# EAGLE schematic IMD_AMS_Latch (EAGLE 9.2.2)
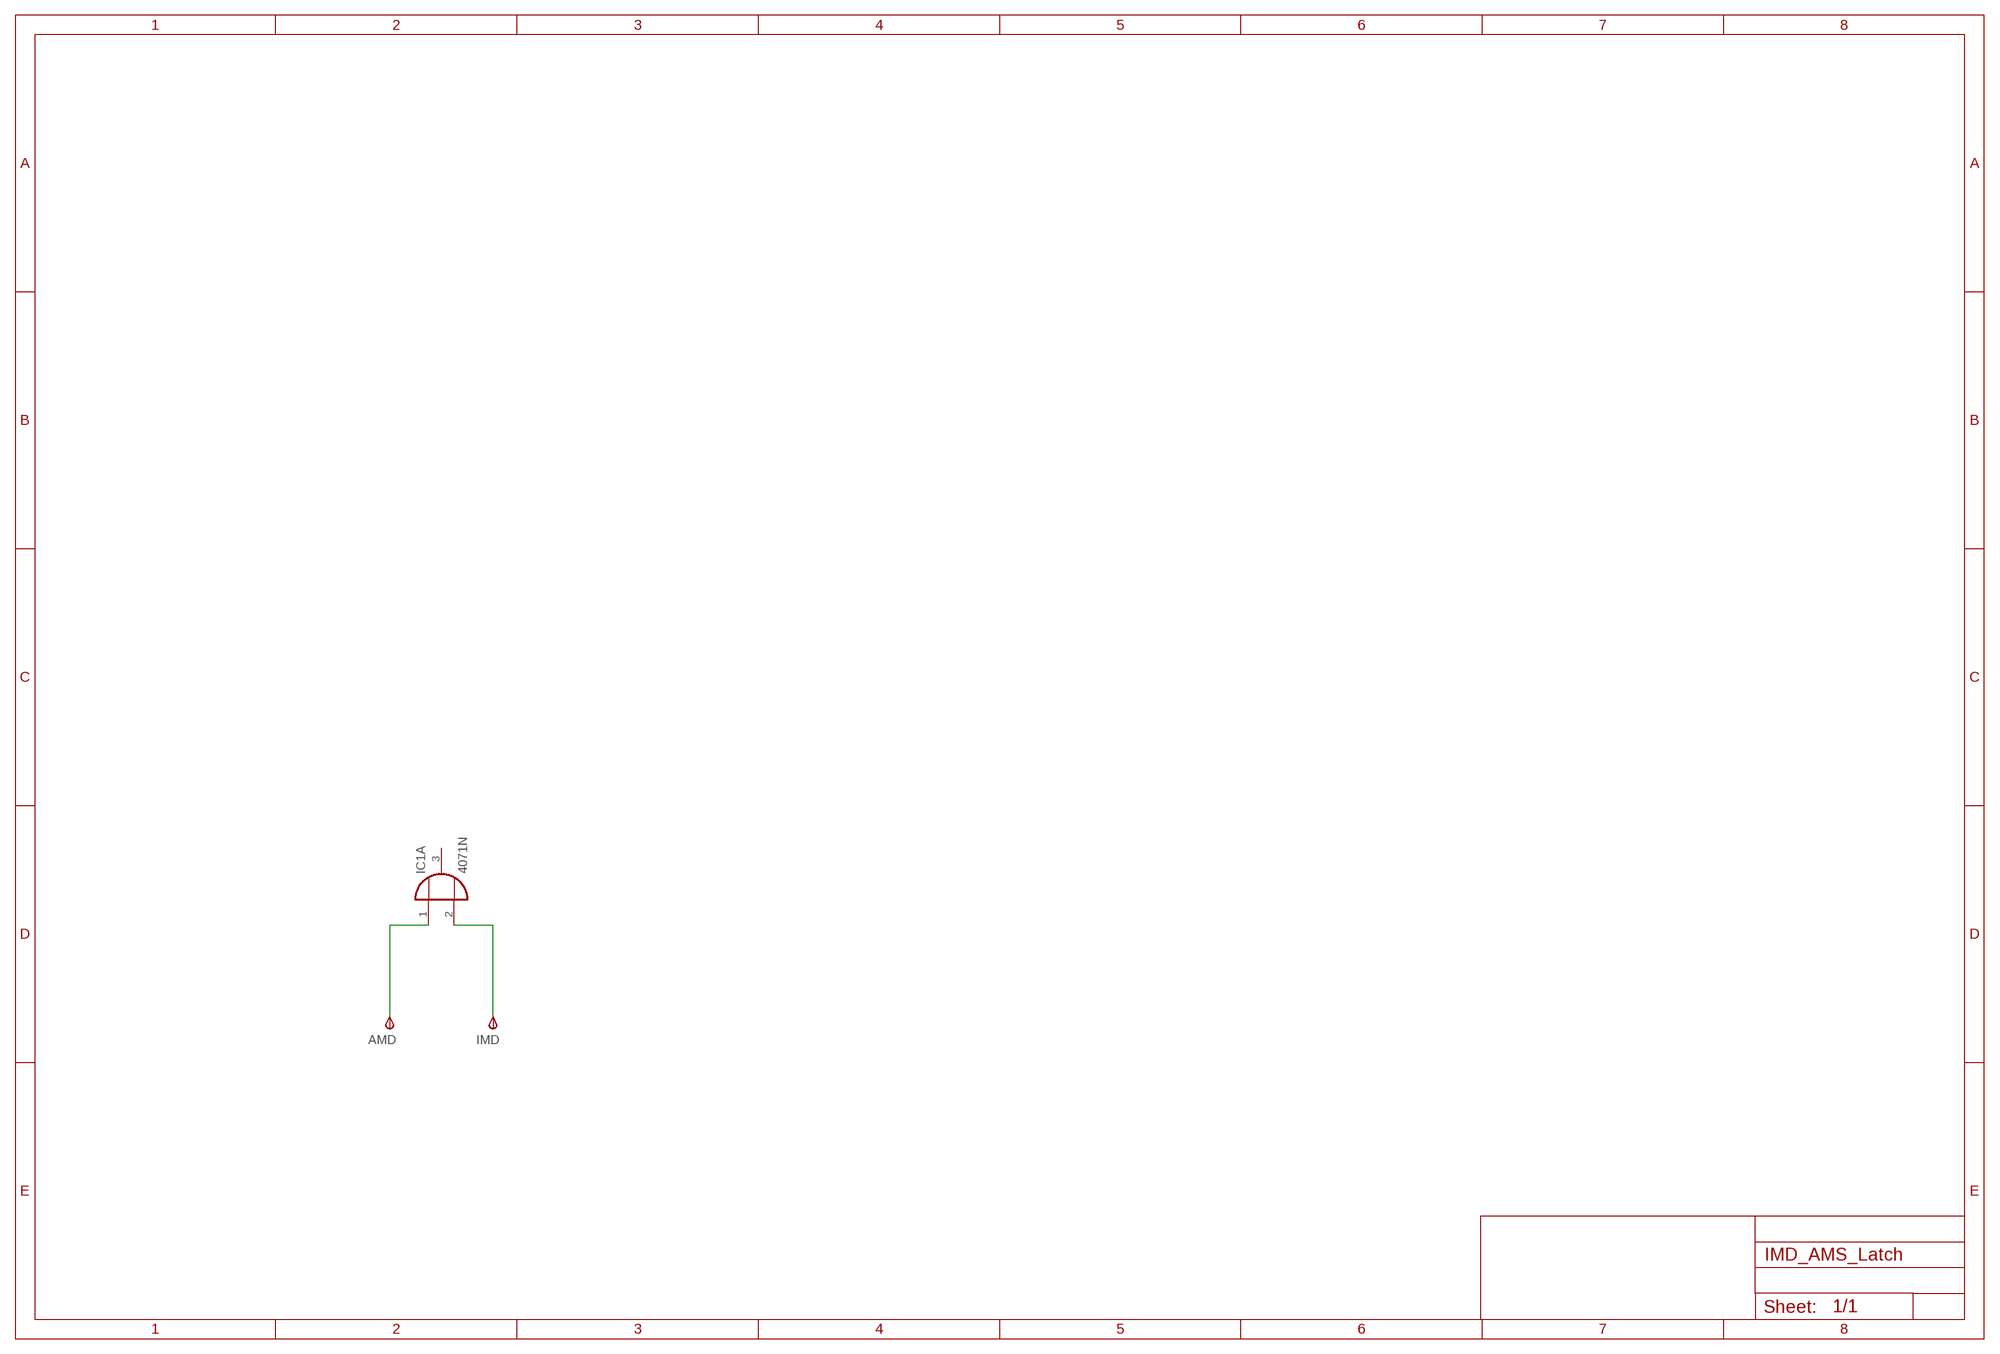
[diagram p0: schematic, sheet 1]

## Parts
AMD  TPSPAD1-13  [P1-13]
IC1  4071N  [DIL14]
IMD  TPSPAD1-13  [P1-13]

## Nets
N$1: AMD.TP(PP) IC1.1(A:I0)
N$2: IC1.2(A:I1) IMD.TP(PP)
Unconnected: IC1.3(A:O) IC1.4(B:O) IC1.5(B:I0) IC1.6(B:I1) IC1.8(C:I0) IC1.9(C:I1) IC1.10(C:O) IC1.11(D:O) IC1.12(D:I0) IC1.13(D:I1)

## Power pins joined to a net without a drawn wire
VDD: IC1.14(P:VDD)
VSS: IC1.7(P:VSS)

## Library data of the parts
AMD IMD = testpad:TPS: TEST PIN
IC1 = 40xx:4071: Quad 2-input OR